# Altium schematic sheet PWR_Supply-5.5V.SchDoc: Phaser
size 420 x 297 mm; Author: G.Kasprowicz; CompanyName: WUT ISE; DrawnBy: G.Kasprowicz; Organization: WUT ISE; Address1: PW ISE; Address2: Nowowiejska 15/19 00-665 Warsaw; Address3: gkasprow@gmail.com; DocumentNumber: 17; Revision: 2; SheetNumber: 17; SheetTotal: 18; ModifiedBy: -; CheckedDate: -; Title2: P5V5 power rail and converters; DivGrp: WUT ISE; Designer: G.Kasprowicz; ModifiedDate: -; ProjectName: Sensor Box
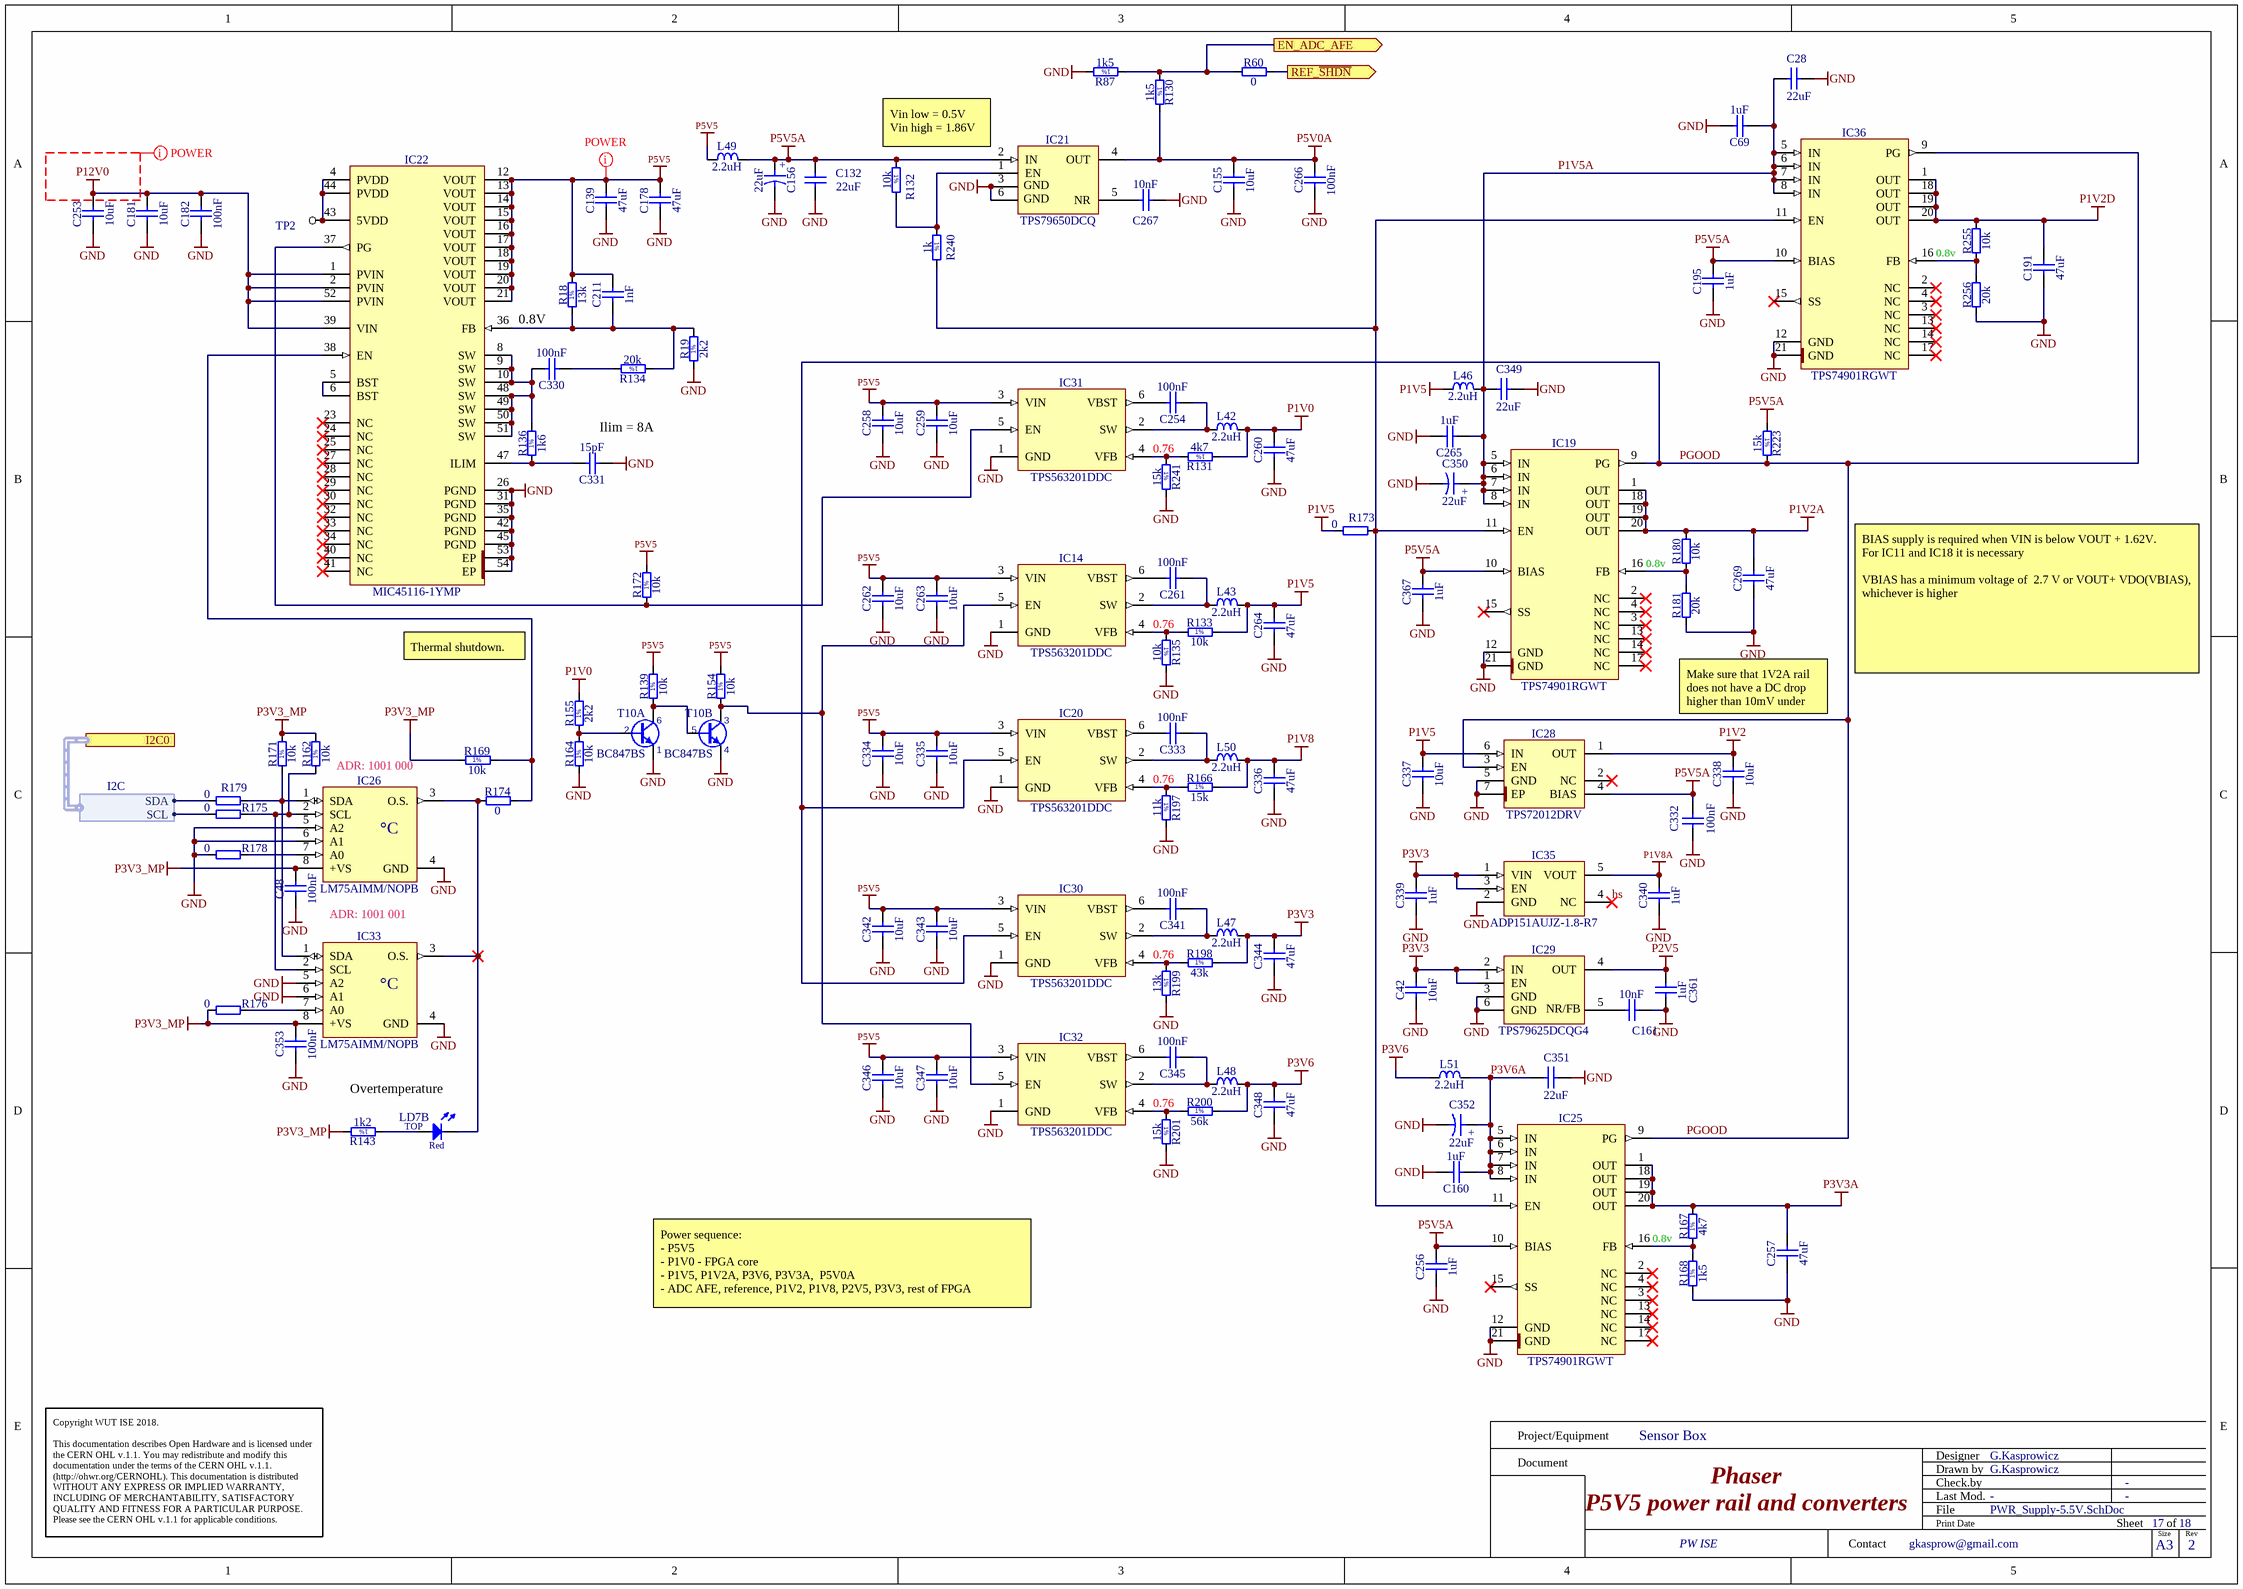
[diagram p0: PWR_Supply-5.5V.SchDoc]

## Parts
C28  22uF  [CAPC2012X135N]
C42  10uF  [CAPC2012X135N]
C48  100nF  [CAPC1005X55N]
C69  1uF  [CAPC1005X55N]
C132  22uF  [CAPC2012X135N]
C139  47uF  [CAPC3225X270N]
C155  10uF  [CAPC2012X135N]
C156  22uF  [CAPMP3528X210N]
C160  1uF  [CAPC1005X55N]
C161  10nF  [CAPC1005X55N]
C178  47uF  [CAPC3225X270N]
C181  10uF  [CAPC2012X135N]
C182  100nF  [CAPC1005X55N]
C191  47uF  [CAPC3225X270N]
C195  1uF  [CAPC1005X55N]
C211  1nF  [CAPC1608X87N]
C253  10uF  [CAPC2012X135N]
C254  100nF  [CAPC1005X55N]
C256  1uF  [CAPC1005X55N]
C257  47uF  [CAPC3225X270N]
C258  10uF  [CAPC2012X135N]
C259  10uF  [CAPC2012X135N]
C260  47uF  [CAPC3225X270N]
C261  100nF  [CAPC1005X55N]
C262  10uF  [CAPC2012X135N]
C263  10uF  [CAPC2012X135N]
C264  47uF  [CAPC3225X270N]
C265  1uF  [CAPC1005X55N]
C266  100nF  [CAPC1005X55N]
C267  10nF  [CAPC1005X55N]
C269  47uF  [CAPC3225X270N]
C330  100nF  [CAPC1005X55N]
C331  15pF  [CAPC1005X55N]
C332  100nF  [CAPC1005X55N]
C333  100nF  [CAPC1005X55N]
C334  10uF  [CAPC2012X135N]
C335  10uF  [CAPC2012X135N]
C336  47uF  [CAPC3225X270N]
C337  10uF  [CAPC2012X135N]
C338  10uF  [CAPC2012X135N]
C339  1uF  [CAPC1608X87N]
C340  1uF  [CAPC1608X87N]
C341  100nF  [CAPC1005X55N]
C342  10uF  [CAPC2012X135N]
C343  10uF  [CAPC2012X135N]
C344  47uF  [CAPC3225X270N]
C345  100nF  [CAPC1005X55N]
C346  10uF  [CAPC2012X135N]
C347  10uF  [CAPC2012X135N]
C348  47uF  [CAPC3225X270N]
C349  22uF  [CAPC2012X135N]
C350  22uF  [CAPMP3528X210N]
C351  22uF  [CAPC2012X135N]
C352  22uF  [CAPMP3528X210N]
C353  100nF  [CAPC1005X55N]
C361  1uF  [CAPC1608X87N]
C367  1uF  [CAPC1005X55N]
IC14  TPS563201DDC  [SOT95P280X110-6N]
IC19  TPS74901RGWT  [QFN65P500X500X100-21N-S325]
IC20  TPS563201DDC  [SOT95P280X110-6N]
IC21  TPS79650DCQ  [SOT127P700X180-6N]
IC22  MIC45116-1YMP  [MICROCHIP_H3QFN88-52LD-PL-3]
IC25  TPS74901RGWT  [QFN65P500X500X100-21N-S325]
IC26  LM75AIMM/NOPB  [SOP65P490X109-8N]
IC28  TPS72012DRV  [SON65P200X200X80-7N-R110X170]
IC29  TPS79625DCQG4  [SOT127P700X180-6N]
IC30  TPS563201DDC  [SOT95P280X110-6N]
IC31  TPS563201DDC  [SOT95P280X110-6N]
IC32  TPS563201DDC  [SOT95P280X110-6N]
IC33  LM75AIMM/NOPB  [SOP65P490X109-8N]
IC35  ADP151AUJZ-1.8-R7  [SOT95P280X90-5N]
IC36  TPS74901RGWT  [QFN65P500X500X100-21N-S325]
L42  2.2uH  [IND_BOURNS_SRP5015TA]
L43  2.2uH  [IND_BOURNS_SRP5015TA]
L46  2.2uH  [IND_BOURNS_SRP5015TA]
L47  2.2uH  [IND_BOURNS_SRP5015TA]
L48  2.2uH  [IND_BOURNS_SRP5015TA]
L49  2.2uH  [IND_BOURNS_SRP5015TA]
L50  2.2uH  [IND_BOURNS_SRP5015TA]
L51  2.2uH  [IND_BOURNS_SRP5015TA]
LD7  Red/Green  [LED_DIALIGHT_571-0112F]  (value not drawn)  (part B of 2)
R18  13k  [RESC1005X40N]
R19  2k2  [RESC1608X55N]
R60  0  [RESC1005X40N]
R87  1k5  [RESC1608X55N]
R130  1k5  [RESC1608X55N]
R131  4k7  [RESC1005X40N]
R132  10k  [RESC1005X40N]
R133  10k  [RESC1005X40N]
R134  20k  [RESC1005X40N]
R135  10k  [RESC1005X40N]
R136  1k6  [RESC1005X40N]
R139  10k  [RESC1005X40N]
R143  1k2  [RESC1608X55N]
R154  10k  [RESC1005X40N]
R155  2k2  [RESC1608X55N]
R162  10k  [RESC1005X40N]
R164  10k  [RESC1005X40N]
R166  15k  [RESC1005X40N]
R167  4k7  [RESC1608X55N]
R168  1k5  [RESC1608X55N]
R169  10k  [RESC1005X40N]
R171  10k  [RESC1005X40N]
R172  10k  [RESC1005X40N]
R173  0  [RESC1005X40N]
R174  0  [RESC1005X40N]
R175  0  [RESC1005X40N]
R176  0  [RESC1005X40N]
R178  0  [RESC1005X40N]
R179  0  [RESC1005X40N]
R180  10k  [RESC1608X55N]
R181  20k  [RESC1608X55N]
R197  11k  [RESC1005X40N]
R198  43k  [RESC1005X40N]
R199  13k  [RESC1005X40N]
R200  56k  [RESC1005X40N]
R201  15k  [RESC1005X40N]
R223  15k  [RESC1005X40N]
R240  1k  [RESC1608X55N]
R241  15k  [RESC1005X40N]
R255  10k  [RESC1608X55N]
R256  20k  [RESC1608X55N]
T10  BC847BS  [SOT65P210X110-6N]  (parts A,B of 2)
TP2  TP  [TP]  (value not drawn)

## Ports
EN_ADC_AFE (out), I2C0 (harness I2C), REF_~{SHDN} (out)

## Harnesses
I2C: SDA, SCL

## Nets
GND: C28.1 C42.1 C48.1 C69.2 C132.1 C139.1 C155.1 C156.2 C160.2 C161.1 C178.1 C181.1 C182.1 C191.1 C195.1 C253.1 C256.1 C257.1 C258.1 C259.1 C260.1 C262.1 C263.1 C264.1 C265.2 C266.1 C267.1 C269.1 C331.1 C332.1 C334.1 C335.1 C336.1 C337.1 C338.1 C339.1 C340.1 C342.1 C343.1 C344.1 C346.1 C347.1 C348.1 C349.1 C350.2 C351.1 C352.2 C353.1 C361.1 C367.1 IC14.1(GND) IC19.12(GND) IC19.21(GND) IC20.1(GND) IC21.3(GND) IC21.6(GND) IC22.26(PGND) IC22.31(PGND) IC22.35(PGND) IC22.42(PGND) IC22.45(PGND) IC22.53(EP) IC22.54(EP) IC25.12(GND) IC25.21(GND) IC26.4(GND) IC26.5(A2) IC26.6(A1) IC28.5(GND) IC28.7(EP) IC29.3(GND) IC29.6(GND) IC30.1(GND) IC31.1(GND) IC32.1(GND) IC33.4(GND) IC33.5(A2) IC33.6(A1) IC35.2(GND) IC36.12(GND) IC36.21(GND) R19.1 R87.2 R135.2 R164.1 R168.1 R178.1 R181.1 R197.2 R199.2 R201.2 R241.2 R256.1 T10.1(E) T10.4(E)
P1V0: C260.2 L42.2 R131.1 R155.2
P1V2: C338.2 IC28.1(OUT)
P1V2A: C269.2 IC19.1(OUT) IC19.18(OUT) IC19.19(OUT) IC19.20(OUT) R180.2
P1V2D: C191.2 IC36.1(OUT) IC36.18(OUT) IC36.19(OUT) IC36.20(OUT) R255.2
P1V5: C264.2 C337.2 IC28.6(IN) L43.2 L46.1 R133.2 R173.1
P1V8: C336.2 L50.2 R166.2
P1V8A: C340.2 IC35.5(VOUT)
P2V5: C361.2 IC29.4(OUT)
P3V3: C42.2 C339.2 C344.2 IC29.1(EN) IC29.2(IN) IC35.1(VIN) IC35.3(EN) L47.2 R198.2
P3V3_MP: C48.2 C353.2 IC26.8(+VS) IC33.8(+VS) R143.2 R162.2 R169.1 R171.2 R176.1
P3V3A: C257.2 IC25.1(OUT) IC25.18(OUT) IC25.19(OUT) IC25.20(OUT) R167.2
P3V6: C348.2 L48.2 L51.1 R200.2
P5V0A: C155.2 C266.2 IC21.4(OUT) R130.2
P5V5: C139.2 C178.2 C211.2 C258.2 C259.2 C262.2 C263.2 C334.2 C335.2 C342.2 C343.2 C346.2 C347.2 IC14.3(VIN) IC20.3(VIN) IC22.12(VOUT) IC22.13(VOUT) IC22.14(VOUT) IC22.15(VOUT) IC22.16(VOUT) IC22.17(VOUT) IC22.18(VOUT) IC22.19(VOUT) IC22.20(VOUT) IC22.21(VOUT) IC30.3(VIN) IC31.3(VIN) IC32.3(VIN) L49.1 R18.2 R139.2 R154.2 R172.2
P5V5A: C132.2 C156.1 C195.2 C256.2 C332.2 C367.2 IC19.10(BIAS) IC21.2(IN) IC25.10(BIAS) IC28.4(BIAS) IC36.10(BIAS) L49.2 R132.1 R223.1
P12V0: C181.2 C182.2 C253.2 IC22.1(PVIN) IC22.2(PVIN) IC22.39(VIN) IC22.52(PVIN)
EN_ADC_AFE: R60.1 R87.1 R130.1 ; port EN_ADC_AFE
hs: IC35.4(NC)
P1V5A: C28.2 C69.1 C265.1 C349.2 C350.1 IC19.5(IN) IC19.6(IN) IC19.7(IN) IC19.8(IN) IC36.5(IN) IC36.6(IN) IC36.7(IN) IC36.8(IN) L46.2
P3V6A: C160.1 C351.2 C352.1 IC25.5(IN) IC25.6(IN) IC25.7(IN) IC25.8(IN) L51.2
PGOOD: IC19.9(PG) IC20.5(EN) IC25.9(PG) IC28.3(EN) IC30.5(EN) IC36.9(PG) R223.2
REF_~{SHDN}: R60.2 ; port REF_~{SHDN}
NetC161_2: C161.2 IC29.5(NR/FB)
NetC211_1: C211.1 IC22.36(FB) R18.1 R19.2 R134.1
NetC254_1: C254.1 IC31.2(SW) L42.1
NetC254_2: C254.2 IC31.6(VBST)
NetC261_1: C261.1 IC14.2(SW) L43.1
NetC261_2: C261.2 IC14.6(VBST)
NetC267_2: C267.2 IC21.5(NR)
NetC330_1: C330.1 R134.2
NetC330_2: C330.2 IC22.8(SW) IC22.9(SW) IC22.10(SW) IC22.48(SW) IC22.49(SW) IC22.50(SW) IC22.51(SW) R136.2
NetC331_2: C331.2 IC22.47(ILIM) R136.1
NetC333_1: C333.1 IC20.2(SW) L50.1
NetC333_2: C333.2 IC20.6(VBST)
NetC341_1: C341.1 IC30.2(SW) L47.1
NetC341_2: C341.2 IC30.6(VBST)
NetC345_1: C345.1 IC32.2(SW) L48.1
NetC345_2: C345.2 IC32.6(VBST)
NetIC14_4: IC14.4(VFB) R133.1 R135.1
NetIC14_5: IC14.5(EN) IC32.5(EN) R154.1 T10.3(C)
NetIC19_11: IC19.11(EN) IC25.11(EN) IC36.11(EN) R173.2 R240.2
NetIC19_16: IC19.16(FB) R180.1 R181.2
NetIC20_4: IC20.4(VFB) R166.1 R197.1
NetIC21_1: IC21.1(EN) R132.2 R240.1
NetIC22_4: IC22.4(PVDD) IC22.43(5VDD) IC22.44(PVDD) TP2.1
NetIC22_5: IC22.5(BST) IC22.6(BST)
NetIC22_37: IC22.37(PG) IC31.5(EN) R172.1
NetIC22_38: IC22.38(EN) R169.2 R174.2
NetIC25_16: IC25.16(FB) R167.1 R168.2
NetIC26_1: IC26.1(SDA) IC33.1(SDA) R171.1 R179.2
NetIC26_2: IC26.2(SCL) IC33.2(SCL) R162.1 R175.2
NetIC26_3: IC26.3(O.S.) IC33.3(O.S.) LD7.3(C) R174.1
NetIC26_7: IC26.7(A0) R178.2
NetIC30_4: IC30.4(VFB) R198.1 R199.1
NetIC31_4: IC31.4(VFB) R131.2 R241.1
NetIC32_4: IC32.4(VFB) R200.1 R201.1
NetIC33_7: IC33.7(A0) R176.2
NetIC36_16: IC36.16(FB) R255.1 R256.2
NetLD7_4: LD7.4(A) R143.1
NetR139_1: R139.1 T10.5(B) T10.6(C)
NetR155_1: R155.1 R164.2 T10.2(B)
NetR175_1: R175.1 ; port I2C0.SCL
NetR179_1: R179.1 ; port I2C0.SDA

Not connected (* = marked no-connect by the designer): IC19 2(NC)* 3(NC)* 4(NC)* 13(NC)* 14(NC)* 15(SS)* 17(NC)*; IC22 23(NC)* 24(NC)* 25(NC)* 27(NC)* 28(NC)* 29(NC)* 30(NC)* 32(NC)* 33(NC)* 34(NC)* 40(NC)* 41(NC)*; IC25 2(NC)* 3(NC)* 4(NC)* 13(NC)* 14(NC)* 15(SS)* 17(NC)*; IC28 2(NC)*; IC36 2(NC)* 3(NC)* 4(NC)* 13(NC)* 14(NC)* 15(SS)* 17(NC)*

## Layout directives
net class POWER: P5V5, P12V0

## Notes on the sheet
- Vin low = 0.5V
  Vin high = 1.86V
- 0.8v
- 0.8V
- (near C331) Ilim = 8A
- 0.76
- Thermal shutdown.
- BIAS supply is required when VIN is below VOUT + 1.62V.
  For IC11 and IC18 it is necessary
  VBIAS has a minimum voltage of  2.7 V or VOUT+ VDO(VBIAS), whichever is higher
- Make sure that 1V2A rail does not have a DC drop higher than 10mV under full load
- ADR: 1001 000
- ADR: 1001 001
- Overtemperature
- Power sequence:
  - P5V5
  - P1V0 - FPGA core
  - P1V5, P1V2A, P3V6, P3V3A,  P5V0A
  - ADC AFE, reference, P1V2, P1V8, P2V5, P3V3, rest of FPGA
- Project/Equipment
- Document
- Designer
- Drawn by
- Check.by
- Copyright WUT ISE 2018.
  This documentation describes Open Hardware and is licensed under the CERN OHL v.1.1. You may redistribute and modify this documentation under the terms of the CERN OHL v.1.1. (http://ohwr.org/CERNOHL). This documentation is distributed WITHOUT ANY EXPRESS OR IMPLIED WARRANTY, INCLUDING OF MERCHANTABILITY, SATISFACTORY QUALITY AND FITNESS FOR A PARTICULAR PURPOSE. Please see the CERN OHL v.1.1 for applicable conditions.
- Contact
- File
- Last Mod.
- Print Date
- Sheet
- Size
- A3
- of
- Rev
- (in symbol CTE3528-21_22UF_10V_10%_LESR0700) +
- (in symbol LED_DIALIGHT_571-0112F, part B) TOP; Red
- (in symbol LM75AIMM/NOPB) °C
- (in symbol R0402_1K6_1%_0.0625W_100PPM) 1%
- (in symbol R0402_4K7_1%_0.0625W_100PPM) 1%
- (in symbol R0402_10K_1%_0.0625W_100PPM) 1%
- (in symbol R0402_10k_1%_0.0625W_100PPM) 1%
- (in symbol R0402_11K_1%_0.0625W_100PPM) 1%
- (in symbol R0402_13K_1%_0.0625W_100PPM) 1%
- (in symbol R0402_15K_1%_0.0625W_100PPM) 1%
- (in symbol R0402_20K_1%_0.0625W_100PPM) 1%
- (in symbol R0402_43K_1%_0.0625W_100PPM) 1%
- (in symbol R0402_56K_1%_0.0625W_100PPM) 1%
- (in symbol R0603_1K2_1%_0.1W_100PPM) 1%
- (in symbol R0603_1K5_1%_0.1W_100PPM) 1%
- (in symbol R0603_1K_1%_0.1W_100PPM) 1%
- (in symbol R0603_2k2_1%_0.1W_100PPM) 1%
- (in symbol R0603_4K7_1%_0.1W_100PPM) 1%

## Library data of the parts
C28 C132 C349 C351 = CC0805_22UF_16V_10%_X5R: Non-polarised capacitor; Part Description: SMD Multilayer Chip Ceramic Capacitor; Manufacturer: GENERIC; Manufacturer1 Part Number: C2012X5R1C226KT; Voltage: 16V; TC: X5R; Tolerance: ±10%; Part Number: CC0805_22UF_16V_10%_X5R; Component Kind: Standard; Component Type: Standard; Pin Count: 2; Value: 22uF; Status: Preferred; Manufacturer Part Number: CC0805_22UF_16V_10%_X5R; Case: 0805; Mounted: Yes; Socket: No; SMD: Yes; Sense: No; Manufacturer1 Example: TDK; Manufacturer1 ComponentHeight: 1.35mm; HelpURL: \\cern.ch\dfs\Applications\Altium\Datasheets\CC0805_X5R_TDK_C.pdf; Author: CERN DEM JLC; CreateDate: 25.10.2012; LatestRevisionDate: 25.10.2012
C42 C155 C181 C253 C258 C259 C262 C263 C334 C335 C337 C338 C342 C343 C346 C347 = CC0805_10UF_16V_10%_X5R: Non-polarised capacitor; Part Description: SMD Multilayer Chip Ceramic Capacitor; Manufacturer: GENERIC; Manufacturer1 Part Number: C0805C106K4PAC; Voltage: 16V; TC: X5R; Tolerance: ±10%; Part Number: CC0805_10UF_16V_10%_X5R; Component Kind: Standard; Component Type: Standard; Pin Count: 2; Value: 10uF; Status: Preferred; Manufacturer Part Number: CC0805_10UF_16V_10%_X5R; Case: 0805; Mounted: Yes; Socket: No; SMD: Yes; Sense: No; Manufacturer1 Example: KEMET; Manufacturer1 ComponentHeight: 1.4mm; HelpURL: \\cern.ch\dfs\Applications\Altium\Datasheets\CC1206_X5R_KEMET.pdf; Author: CERN DEM JLC; CreateDate: 03.12.2007; LatestRevisionDate: 03.12.2007
C48 C266 C353 = CC0402_100NF_16V_10%_X5R: Non-polarised capacitor; Part Description: SMD Multilayer Chip Ceramic Capacitor; Manufacturer: GENERIC; Manufacturer1 Part Number: GRM155R61C104KA88D; Voltage: 16V; TC: X5R; Tolerance: ±10%; Part Number: CC0402_100NF_16V_10%_X5R; Component Kind: Standard; Component Type: Standard; Pin Count: 2; Value: 100nF; Status: None; Manufacturer Part Number: CC0402_100NF_16V_10%_X5R; Case: 0402; Mounted: Yes; Socket: No; SMD: Yes; Sense: No; Manufacturer1 Example: MURATA; Manufacturer1 ComponentHeight: 0.55mm; HelpURL: \\cern.ch\dfs\Applications\Altium\Datasheets\CC0402_X5R_MURATA_GRM.pdf; Author: CERN DEM JLC; CreateDate: 10.12.2013; LatestRevisionDate: 10.12.2013
C69 C160 C195 C256 C265 C367 = CC0402_1UF_16V_10%_X5R: Non-polarised capacitor; Part Description: SMD Multilayer Chip Ceramic Capacitor; Manufacturer: GENERIC; Manufacturer1 Part Number: C1005X5R1C105KT; Voltage: 16V; TC: X5R; Tolerance: ±10%; Part Number: CC0402_1UF_16V_10%_X5R; Component Kind: Standard; Component Type: Standard; Pin Count: 2; Value: 1uF; Status: Preferred; Manufacturer Part Number: CC0402_1UF_16V_10%_X5R; Case: 0402; Mounted: Yes; Socket: No; SMD: Yes; Sense: No; Manufacturer1 Example: TDK; Manufacturer1 ComponentHeight: 0.55mm; HelpURL: \\cern.ch\dfs\Applications\Altium\Datasheets\CC0402_X5R_TDK_C.pdf; Author: CERN DEM JLC; CreateDate: 2012-10-25; LatestRevisionDate: 2012-10-25
C139 C178 C191 C257 C260 C264 C269 C336 C344 C348 = CC1210_47UF_10V_20%_X5R: Non-polarised capacitor; Part Description: SMD Multilayer Chip Ceramic Capacitor; Manufacturer: GENERIC; Manufacturer1 Part Number: LMK325BJ476MM-T; Voltage: 10V; TC: X5R; Tolerance: ±20%; Part Number: CC1210_47UF_10V_20%_X5R; Component Kind: Standard; Component Type: Standard; Pin Count: 2; Value: 47uF; Status: None; Manufacturer Part Number: CC1210_47UF_10V_20%_X5R; Case: 1210; Mounted: Yes; Socket: No; SMD: Yes; Sense: No; Manufacturer1 Example: TAIYO YUDEN; Manufacturer1 ComponentHeight: 2.7mm; HelpURL: \\cern.ch\dfs\Applications\Altium\Datasheets\CC1210_X5R_TAIYO-YUDEN_HIGH-VALUE.pdf; Author: CERN DEM JLC; CreateDate: 04.05.2011; LatestRevisionDate: 04.05.2011
C156 C350 C352 = CTE3528-21_22UF_10V_10%_LESR0700: Polarised capacitor; Part Description: Low ESR 0R7 Solid Tantalum Chip Capacitor; Manufacturer: GENERIC; Manufacturer1 Part Number: TPSB226K010R0700; Voltage: 10V; Tolerance: ±10%; Part Number: CTE3528-21_22UF_10V_10%_LESR0700; Component Kind: Standard; Component Type: Standard; Pin Count: 2; Value: 22uF; Status: Preferred; Manufacturer Part Number: CTE3528-21_22UF_10V_10%_LESR0700; Case: B; Mounted: Yes; Socket: No; SMD: Yes; Sense: No; Manufacturer1 Example: AVX; Manufacturer1 ComponentHeight: 2.1mm; HelpURL: \\cern.ch\dfs\Applications\Altium\Datasheets\CTE-LESR_AVX_TPS.pdf; Author: CERN DEM JLC; CreateDate: 05.05.2008; LatestRevisionDate: 20.01.2009
C161 C267 = CC0402_10NF_25V_10%_X7R: Non-polarised capacitor; Part Description: SMD Multilayer Chip Ceramic Capacitor; Manufacturer: GENERIC; Manufacturer1 Part Number: C1005X7R1E103KT; Voltage: 25V; TC: X7R; Tolerance: ±10%; Part Number: CC0402_10NF_25V_10%_X7R; Component Kind: Standard; Component Type: Standard; Pin Count: 2; Value: 10nF; Status: Preferred; Manufacturer Part Number: CC0402_10NF_25V_10%_X7R; Case: 0402; Mounted: Yes; Socket: No; SMD: Yes; Sense: No; Manufacturer1 Example: TDK; Manufacturer1 ComponentHeight: 0.55mm; HelpURL: \\cern.ch\dfs\Applications\Altium\Datasheets\CC0402_X7R_TDK_C.pdf; Author: CERN DEM JLC; CreateDate: 25.10.2012; LatestRevisionDate: 25.10.2012
C182 C254 C261 C330 C332 C333 C341 C345 = CC0402_100NF_16V_10%_X5R: Non-polarised capacitor; Part Description: SMD Multilayer Chip Ceramic Capacitor; Manufacturer: GENERIC; Manufacturer1 Part Number: GRM155R61C104KA88D; Voltage: 16V; TC: X5R; Tolerance: ±10%; Table: Capacitors SMD; Part Number: CC0402_100NF_16V_10%_X5R; Component Kind: Standard; Component Type: Standard; Pin Count: 2; Value: 100nF; Status: None; Manufacturer Part Number: CC0402_100NF_16V_10%_X5R; Case: 0402; Mounted: Yes; Socket: No; SMD: Yes; Manufacturer1 Example: MURATA; Manufacturer1 ComponentHeight: 0.55mm; HelpURL: \\cern.ch\dfs\Applications\Altium\Datasheets\CC0402_X5R_MURATA_GRM.pdf; Author: CERN DEM JLC; CreateDate: 2013-12-10; LatestRevisionDate: 2013-12-10
C211 = CC0603_1NF_100V_10%_X7R: Non-polarised capacitor; Part Description: SMD Multilayer Chip Ceramic Capacitor; Manufacturer: GENERIC; Manufacturer1 Part Number: C0603C102K1RACTU; Voltage: 100V; TC: X7R; Tolerance: ±10%; Part Number: CC0603_1NF_100V_10%_X7R; Component Kind: Standard; Component Type: Standard; Pin Count: 2; Value: 1nF; Status: Preferred; Manufacturer Part Number: CC0603_1NF_100V_10%_X7R; Case: 0603; Mounted: Yes; Socket: No; SMD: Yes; Sense: No; Manufacturer1 Example: KEMET; Manufacturer1 ComponentHeight: 0.87mm; HelpURL: \\cern.ch\dfs\Applications\Altium\Datasheets\CC0603_X7R_KEMET.pdf; Author: CERN DEM JLC; CreateDate: 12.12.2013; LatestRevisionDate: 12.12.2013
C331 = CC0402_15PF_50V_5%_C0G: Non-polarised capacitor; Part Description: SMD Multilayer Chip Ceramic Capacitor; Manufacturer: GENERIC; Manufacturer1 Part Number: C0402C150J5GACTU; Voltage: 50V; TC: C0G/NP0; Tolerance: ±5%; Part Number: CC0402_15PF_50V_5%_C0G; Component Kind: Standard; Component Type: Standard; Pin Count: 2; Value: 15pF; Status: Preferred; Manufacturer Part Number: CC0402_15PF_50V_5%_C0G; Case: 0402; Mounted: Yes; Socket: No; SMD: Yes; Sense: No; Manufacturer1 Example: KEMET; Manufacturer1 ComponentHeight: 0.55mm; HelpURL: \\cern.ch\dfs\Applications\Altium\Datasheets\CC0805_C0G_KEMET_(Commercial Grade).pdf; Author: CERN DEM JLC; CreateDate: 03.12.2007; LatestRevisionDate: 22.04.2015
C339 C340 C361 = CC0603_1UF_25V_10%_X7R: Non-polarised capacitor; Part Description: SMD Multilayer Chip Ceramic Capacitor; Manufacturer: GENERIC; Manufacturer1 Part Number: GRM188R71E105KA12D; Voltage: 25V; TC: X7R; Tolerance: ±10%; Part Number: CC0603_1UF_25V_10%_X7R; Component Kind: Standard; Component Type: Standard; Pin Count: 2; Value: 1uF; Status: None; Manufacturer Part Number: CC0603_1UF_25V_10%_X7R; Case: 0603; Mounted: Yes; Socket: No; SMD: Yes; Sense: No; Manufacturer1 Example: MURATA; Manufacturer1 ComponentHeight: 0.9mm; HelpURL: \\cern.ch\dfs\Applications\Altium\Datasheets\CC0603_X7R_MURATA.pdf; Author: CERN DEM JLC; CreateDate: 18.01.2011; LatestRevisionDate: 18.01.2011
IC14 IC20 IC30-IC32 = TPS563201DDC: 4.5V to 17V Input, 3A Synchronous Step-Down Voltage Regulator; Manufacturer: TEXAS INSTRUMENTS; PressFit: No; Bonding: No; Part Number: TPS563201DDC; Component Kind: Standard; Component Type: Standard; Device: TPS563201DDC; PackageDescription: SOT, 0.95mm Pitch; 6 Pin, 1.60mm W X 2.90mm L X 1.10mm H Body, IPC Medium Density; Part Description: 4.5V to 17V Input, 3A Synchronous Step-Down Voltage Regulator; Manufacturer Part Number: TPS563201DDC; Pin Count: 6; Case: SOT23-6; Mounted: Yes; Socket: No; SMD: Yes; Sense: No; ComponentHeight: 1.1mm; HelpURL: \\cern.ch\dfs\Applications\Altium\Datasheets\TPS563201DDC.pdf; Author: CERN DEM MR; CreateDate: 23.08.2018; LatestRevisionDate: 23.08.2018
IC19 IC25 IC36 = TPS74901RGWT: 3A, 0.8 to 3.6V Adjustable Low-Dropout Linear Regulator with Programmable Soft-Start; Part Description: 0.8V to 3.6V, 3.0A Low Dropout Linear Regulator with Programmable Soft-Start; Manufacturer: TEXAS INSTRUMENTS; PressFit: No; Bonding: No; Part Number: TPS74901RGWT; Component Kind: Standard; Component Type: Standard; Device: TPS74901RGWT; PackageDescription: QFN, 0.65mm pitch,square; 20 pin, 5mm X 5mm X 1mm H body (w/thermal tab 3.25 X 3.25mm),  IPC Medium Density; Manufacturer Part Number: TPS74901RGWT; Pin Count: 21; Case: QFN20; Mounted: Yes; Socket: No; SMD: Yes; Sense: No; ComponentHeight: 1mm; HelpURL: \\cern.ch\dfs\Applications\Altium\Datasheets\TPS74901RGWT.pdf; Author: CERN DEM JLC; CreateDate: 07.03.2013; LatestRevisionDate: 07.03.2013
IC21 = TPS79650DCQ: 5V Ultralow-Noise, High-PSRR, Fast, RF, 1.5A Low-Dropout Linear Regulator; Manufacturer: TEXAS INSTRUMENTS; PressFit: No; Bonding: No; Part Number: TPS79650DCQ; Component Kind: Standard; Component Type: Standard; Device: TPS79650DCQ; PackageDescription: SOT223, 6-Leads, Body 6.6x7.3mm (max), Pitch 1.27mm, IPC Medium Density; Part Description: 5V Ultralow-Noise, High-PSRR, Fast, RF, 1.5A Low-Dropout Linear Regulator; Manufacturer Part Number: TPS79650DCQ; Pin Count: 6; Case: SOT223; Mounted: Yes; Socket: No; SMD: Yes; Sense: No; ComponentHeight: 1.8mm; HelpURL: \\cern.ch\dfs\Applications\Altium\Datasheets\TPS78633DCQ.pdf; Author: GK; CreateDate: 07.10.2008; LatestRevisionDate: 13.02.2017
IC22 = MIC45116-1YMP: 0.8V to 85% PVIN (4.75-19V), 6A Synchronous Step-Down Regulator Module; Manufacturer: MICROCHIP TECHNOLOGY; PressFit: No; Bonding: No; Part Number: MIC45116-1YMP; Component Kind: Standard; Component Type: Standard; Device: MIC45116-1YMP; PackageDescription: MICROCHIP_H3QFN88-52LD-PL-3, 0.50mm Pitch, Square, 52 Pin, 8mm L X 8mm W X 3mm H Body; Part Description: 0.8V to 85% PVIN (4.75-19V), 6A Synchronous Step-Down Regulator Module; Manufacturer Part Number: MIC45116-1YMP; Pin Count: 53; Mounted: Yes; Socket: No; SMD: Yes; Sense: No; ComponentHeight: 3mm; HelpURL: \\cern.ch\dfs\Applications\Altium\Datasheets\MIC45116-1YMP.pdf; Author: CERN DEM JMW; CreateDate: 15.08.2016; LatestRevisionDate: 15.08.2016
IC26 IC33 = LM75AIMM/NOPB: Digital Temperature Sensor and Thermal Watchdog with Two-Wire Interface; Part Description: -25° to +100°C ±2°C Digital Temperature Sensor and Thermal Watchdog with Two-Wire Interface; Manufacturer: TEXAS INSTRUMENTS; PressFit: No; Bonding: No; Part Number: LM75AIMM/NOPB; Component Kind: Standard; Component Type: Standard; Device: LM75AIMM/NOPB; PackageDescription: SOP, 0.65mm pitch; 8 pin,3.00mm W X 3.00mm L X 1.09mm H bodyI, PC Medium Density; Manufacturer Part Number: LM75AIMM/NOPB; Pin Count: 8; Case: SSOP8; Mounted: Yes; Socket: No; SMD: Yes; Sense: No; ComponentHeight: 1.09mm; HelpURL: \\cern.ch\dfs\Applications\Altium\Datasheets\LM75AIMM-NOPB.pdf; Author: CERN DEM JLC; CreateDate: 15.10.2012; LatestRevisionDate: 15.10.2012
IC28 = TPS72012DRV: 350 mA, Ultra-Low VIN, RF Low-Dropout Linear Regulator With Bias Pin; Part Description: 1.2V, 350mA, Ultra-Low Vin, RF Low-Dropout Linear Regulator With Bias Pin; Manufacturer: TEXAS INSTRUMENTS; PressFit: No; Bonding: No; Part Number: TPS72012DRV; Component Kind: Standard; Component Type: Standard; Device: TPS72012DRV; PackageDescription: SON, 0.65mm, Pitch; 6 Pin,2.00mm W X 2.00mm L X 0.80mm H body (W/Thermal Tab 1.1mm X 1.7mm),  IPC Medium Density; Manufacturer Part Number: TPS72012DRV; Pin Count: 7; Case: SON6; Mounted: Yes; Socket: No; SMD: Yes; Sense: No; ComponentHeight: 0.8mm; HelpURL: \\cern.ch\dfs\Applications\Altium\Datasheets\TPS72012DRV.pdf; Author: CERN DEM JMW; CreateDate: 2019-12-02; LatestRevisionDate: 2019-12-02
IC29 = TPS79625DCQG4: Ultralow-Noise, High-PSRR, Fast, RF, 1A Low-Dropout Linear Regulator; Part Description: 2.5V Ultralow-Noise, High-PSRR, Fast, RF, 1A Low-Dropout Linear Regulator; Manufacturer: TEXAS INSTRUMENTS; PressFit: No; Bonding: No; Part Number: TPS79625DCQG4; Component Kind: Standard; Component Type: Standard; Device: TPS79625DCQG4; PackageDescription: SOT223, 6-Leads, Body 6.6x7.3mm (max), Pitch 1.27mm, IPC Medium Density; Manufacturer Part Number: TPS79625DCQG4; Pin Count: 6; Case: SOT223; Mounted: Yes; Socket: No; SMD: Yes; Sense: No; ComponentHeight: 1.8mm; HelpURL: \\cern.ch\dfs\Applications\Altium\Datasheets\TPS79625DCQG4.pdf; Author: CERN DEM JLC; CreateDate: 14.08.2013; LatestRevisionDate: 14.08.2013
IC35 = REG_ADP151AUJZ-1.8-R7: 1.8V Ultralow Noise, 200 mA CMOS Linear Regulator; Part Description: 1.8V, 200mA, Ultralow Noise, CMOS Linear Regulator; Manufacturer: ANALOG DEVICES; PressFit: No; Bonding: No; Part Number: ADP151AUJZ-1.8-R7; Component Kind: Standard; Component Type: Standard; Device: ADP151AUJZ-1.8-R7; PackageDescription: SOT23, 0.95mm pitch; 5 pin, 1.75mm W X 3.00mm L, IPC Medium Density; Manufacturer Part Number: ADP151AUJZ-1.8-R7; Pin Count: 5; Case: SOT23; Mounted: Yes; Socket: No; SMD: Yes; Sense: No; ComponentHeight: 0.9mm; HelpURL: \\cern.ch\dfs\Applications\Altium\Datasheets\ADP151AUJZ-1.2-R7.pdf; Author: GK; CreateDate: 21.11.2011; LatestRevisionDate: 19.06.2014
L42 L43 L46-L51 = IND_2.2UH_20%_BOURNS_SRP5015TA: Inductor; Part Description: Shielded SMD Power Inductor; Manufacturer: BOURNS; Manufacturer Part Number: SRP5015TA-2R2M; Power: 4A; Resistance: 0.045R; Tolerance: ±20%; Part Number: IND_2.2UH_20%_BOURNS_SRP5015TA; Component Kind: Standard; Component Type: Standard; Pin Count: 2; Value: 2.2uH; Status: None; Mounted: Yes; Socket: No; SMD: Yes; Sense: No; ComponentHeight: 1.5mm; HelpURL: \\cern.ch\dfs\Applications\Altium\Datasheets\IND_BOURNS_SRP5015TA.pdf; Author: CERN DEM JMW; CreateDate: 24.06.2019; LatestRevisionDate: 24.06.2019
LD7 = LED_DIALIGHT_571-0112F: 2x LED  Botom Green, Top Red; Part Description: Dual 2mm  LEDs, Red Top,Green Bot, CBI® Circuit Board Indicator (Without positioning pins); PressFit: No; Bonding: No; Part Number: LED_DIALIGHT_571-0112F; Component Kind: Standard; Component Type: Standard; Color: Red/Green; PackageDescription: 2x 2mm LED (Top: Red, Bot: Green) PCB Edge Mounting (Without positioning pins) DIALIGHT 571 Serie; Manufacturer: DIALIGHT; Manufacturer Part Number: 571-0112F; Pin Count: 4; Mounted: Yes; Socket: No; SMD: No; Sense: No; ComponentHeight: 8.6mm; HelpURL: \\cern.ch\dfs\Applications\Altium\Datasheets\LED_DIALIGHT_571-0112F.pdf; Author: CERN DEM JLC; CreateDate: 09.11.2009; LatestRevisionDate: 17.03.2010
R18 R199 = R0402_13K_1%_0.0625W_100PPM: Resistor - 1%; Part Description: General Purpose Thick Film Chip Resistor; Manufacturer: GENERIC; Manufacturer1 Part Number: 232270671303L; TC: ±100ppm/°C; PressFit: No; Part Number: R0402_13K_1%_0.0625W_100PPM; Component Kind: Standard; Component Type: Standard; Pin Count: 2; Value: 13k; Status: Not Recommended; Power: 0.0625W; Tolerance: ±1%; Manufacturer Part Number: R0402_13K_1%_0.0625W_100PPM; Case: 0402; Mounted: Yes; Sense: No; Socket: No; SMD: Yes; Manufacturer1 Example: YAGEO PHYCOMP; Manufacturer1 ComponentHeight: 0.4mm; HelpURL: \\cern.ch\dfs\Applications\Altium\Datasheets\R0402_Phycomp_RC0402.pdf; Author: CERN DEM JLC; CreateDate: 03.12.2007; LatestRevisionDate: 17.10.2012
R19 R155 = R0603_2k2_1%_0.1W_100PPM: Resistor - 1%; Part Description: General Purpose Thick Film Chip Resistor; Manufacturer: GENERIC; Manufacturer1 Part Number: NRC06F2201TRF; Power: 0.1W; TC: ±100ppm/°C; PressFit: No; Part Number: R0603_2K2_1%_0.1W_100PPM; Component Kind: Standard; Component Type: Standard; Pin Count: 2; Value: 2k2; Status: Preferred; Tolerance: ±1%; Manufacturer Part Number: R0603_2K2_1%_0.1W_100PPM; Case: 0603; Mounted: Yes; Sense: No; Socket: No; SMD: Yes; Manufacturer1 Example: NIC COMPONENT; Manufacturer1 ComponentHeight: 0.55mm; HelpURL: \\cern.ch\dfs\Applications\Altium\Datasheets\R0603_NIC_NRC.pdf; Author: CERN DEM JLC; CreateDate: 03.12.2007; LatestRevisionDate: 13.03.2008
R60 R173-R176 R178 R179 = R0402_0R_JUMPER: Resistor; Part Description: 1A (0.05R Max DC Resistance) Zero Ohm Jumper; Manufacturer: GENERIC; Manufacturer1 Part Number: 232270591001L; Part Number: R0402_0R_JUMPER; Component Kind: Standard; Component Type: Standard; Pin Count: 2; Value: 0; Status: Not recommended; Manufacturer Part Number: R0402_0R_JUMPER; Case: 0402; Mounted: Yes; Sense: No; Socket: No; SMD: Yes; Manufacturer1 Example: YAGEO PHYCOMP; Manufacturer1 ComponentHeight: 0.4mm; HelpURL: \\cern.ch\dfs\Applications\Altium\Datasheets\R0402_Phycomp_RC0402.pdf; Author: CERN DEM JLC; CreateDate: 03.12.2007; LatestRevisionDate: 17.10.2012
R87 R130 R168 = R0603_1K5_1%_0.1W_100PPM: Resistor - 1%; Part Description: General Purpose Thick Film Chip Resistor; Manufacturer: GENERIC; Manufacturer1 Part Number: NRC06F1501TRF; Power: 0.1W; TC: ±100ppm/°C; PressFit: No; Part Number: R0603_1K5_1%_0.1W_100PPM; Component Kind: Standard; Component Type: Standard; Pin Count: 2; Value: 1k5; Status: Preferred; Tolerance: ±1%; Manufacturer Part Number: R0603_1K5_1%_0.1W_100PPM; Case: 0603; Mounted: Yes; Sense: No; Socket: No; SMD: Yes; Manufacturer1 Example: NIC COMPONENT; Manufacturer1 ComponentHeight: 0.55mm; HelpURL: \\cern.ch\dfs\Applications\Altium\Datasheets\R0603_NIC_NRC.pdf; Author: CERN DEM JLC; CreateDate: 03.12.2007; LatestRevisionDate: 13.03.2008
R131 = R0402_4K7_1%_0.0625W_100PPM: Resistor - 1%; Part Description: General Purpose Thick Film Chip Resistor; Manufacturer: GENERIC; Manufacturer1 Part Number: 232270674702L; TC: ±100ppm/°C; PressFit: No; Part Number: R0402_4K7_1%_0.0625W_100PPM; Component Kind: Standard; Component Type: Standard; Pin Count: 2; Value: 4k7; Status: Not Recommended; Power: 0.0625W; Tolerance: ±1%; Manufacturer Part Number: R0402_4K7_1%_0.0625W_100PPM; Case: 0402; Mounted: Yes; Sense: No; Socket: No; SMD: Yes; Manufacturer1 Example: YAGEO PHYCOMP; Manufacturer1 ComponentHeight: 0.4mm; HelpURL: \\cern.ch\dfs\Applications\Altium\Datasheets\R0402_Phycomp_RC0402.pdf; Author: CERN DEM JLC; CreateDate: 03.12.2007; LatestRevisionDate: 17.10.2012
R132 = R0402_10k_1%_0.0625W_100PPM: Resistor - 1%; Part Description: General Purpose Thick Film Chip Resistor; Manufacturer: GENERIC; Manufacturer1 Part Number: 232270671003L; TC: ±100ppm/°C; PressFit: No; Part Number: R0402_10K_1%_0.0625W_100PPM; Component Kind: Standard; Component Type: Standard; Pin Count: 2; Value: 10k; Status: Not Recommended; Power: 0.0625W; Tolerance: ±1%; Manufacturer Part Number: R0402_10K_1%_0.0625W_100PPM; Case: 0402; Mounted: Yes; Sense: No; Socket: No; SMD: Yes; Manufacturer1 Example: YAGEO PHYCOMP; Manufacturer1 ComponentHeight: 0.4mm; HelpURL: \\cern.ch\dfs\Applications\Altium\Datasheets\R0402_Phycomp_RC0402.pdf; Author: CERN DEM JLC; CreateDate: 03.12.2007; LatestRevisionDate: 17.10.2012
R133 R135 R139 R154 R162 R164 R169 R171 R172 = R0402_10K_1%_0.0625W_100PPM: Resistor - 1%; Part Description: General Purpose Thick Film Chip Resistor; Manufacturer: GENERIC; Manufacturer1 Part Number: 232270671003L; TC: ±100ppm/°C; PressFit: No; Part Number: R0402_10K_1%_0.0625W_100PPM; Component Kind: Standard; Component Type: Standard; Pin Count: 2; Value: 10k; Status: Not Recommended; Power: 0.0625W; Tolerance: ±1%; Manufacturer Part Number: R0402_10K_1%_0.0625W_100PPM; Case: 0402; Mounted: Yes; Sense: No; Socket: No; SMD: Yes; Manufacturer1 Example: YAGEO PHYCOMP; Manufacturer1 ComponentHeight: 0.4mm; HelpURL: \\cern.ch\dfs\Applications\Altium\Datasheets\R0402_Phycomp_RC0402.pdf; Author: CERN DEM JLC; CreateDate: 03.12.2007; LatestRevisionDate: 17.10.2012
R134 = R0402_20K_1%_0.0625W_100PPM: Resistor - 1%; Part Description: General Purpose Thick Film Chip Resistor; Manufacturer: GENERIC; Manufacturer1 Part Number: 232270672003L; TC: ±100ppm/°C; PressFit: No; Part Number: R0402_20K_1%_0.0625W_100PPM; Component Kind: Standard; Component Type: Standard; Pin Count: 2; Value: 20k; Status: Not Recommended; Power: 0.0625W; Tolerance: ±1%; Manufacturer Part Number: R0402_20K_1%_0.0625W_100PPM; Case: 0402; Mounted: Yes; Socket: No; SMD: Yes; Manufacturer1 Example: YAGEO PHYCOMP; Manufacturer1 ComponentHeight: 0.4mm; HelpURL: \\cern.ch\dfs\Applications\Altium\Datasheets\R0402_Phycomp_RC0402.pdf; Author: CERN DEM JLC; CreateDate: 03.12.2007; LatestRevisionDate: 17.10.2012; Sense: No
R136 = R0402_1K6_1%_0.0625W_100PPM: Resistor - 1%; Part Description: General Purpose Thick Film Chip Resistor; Manufacturer: GENERIC; Manufacturer1 Part Number: 232270671602L; TC: ±100ppm/°C; PressFit: No; Part Number: R0402_1K6_1%_0.0625W_100PPM; Component Kind: Standard; Component Type: Standard; Pin Count: 2; Value: 1k6; Status: Not Recommended; Power: 0.0625W; Tolerance: ±1%; Manufacturer Part Number: R0402_1K6_1%_0.0625W_100PPM; Case: 0402; Mounted: Yes; Sense: No; Socket: No; SMD: Yes; Manufacturer1 Example: YAGEO PHYCOMP; Manufacturer1 ComponentHeight: 0.4mm; HelpURL: \\cern.ch\dfs\Applications\Altium\Datasheets\R0402_Phycomp_RC0402.pdf; Author: CERN DEM JLC; CreateDate: 03.12.2007; LatestRevisionDate: 17.10.2012
R143 = R0603_1K2_1%_0.1W_100PPM: Resistor - 1%; Part Description: General Purpose Thick Film Chip Resistor; Manufacturer: GENERIC; Manufacturer1 Part Number: NRC06F1201TRF; Power: 0.1W; TC: ±100ppm/°C; Part Number: R0603_1K2_1%_0.1W_100PPM; Component Kind: Standard; Component Type: Standard; Pin Count: 2; Value: 1k2; Status: Preferred; Tolerance: ±1%; Manufacturer Part Number: R0603_1K2_1%_0.1W_100PPM; Case: 0603; Mounted: Yes; Sense: No; Socket: No; SMD: Yes; Manufacturer1 Example: NIC COMPONENT; Manufacturer1 ComponentHeight: 0.55mm; HelpURL: \\cern.ch\dfs\Applications\Altium\Datasheets\R0603_NIC_NRC.pdf; Author: CERN DEM JLC; CreateDate: 03.12.2007; LatestRevisionDate: 13.03.2008
R166 R201 R223 R241 = R0402_15K_1%_0.0625W_100PPM: Resistor - 1%; Part Description: General Purpose Thick Film Chip Resistor; Manufacturer: GENERIC; Manufacturer1 Part Number: CRCW040215K0FKED; TC: ±100ppm/°C; PressFit: No; Part Number: R0402_15K_1%_0.0625W_100PPM; Component Kind: Standard; Component Type: Standard; Pin Count: 2; Value: 15k; Status: None; Power: 0.0625W; Tolerance: ±1%; Manufacturer Part Number: R0402_15K_1%_0.0625W_100PPM; Case: 0402; Mounted: Yes; Sense: No; Socket: No; SMD: Yes; Manufacturer1 Example: VISHAY; Manufacturer1 ComponentHeight: 0.4mm; HelpURL: \\cern.ch\dfs\Applications\Altium\Datasheets\R0402_VISHAY_CRCW e3.pdf; Author: CERN DEM JMW; CreateDate: 06.07.2015; LatestRevisionDate: 06.07.2015
R167 = R0603_4K7_1%_0.1W_100PPM: Resistor - 1%; Part Description: General Purpose Thick Film Chip Resistor; Manufacturer: GENERIC; Manufacturer1 Part Number: NRC06F4701TRF; Power: 0.1W; TC: ±100ppm/°C; PressFit: No; Part Number: R0603_4K7_1%_0.1W_100PPM; Component Kind: Standard; Component Type: Standard; Pin Count: 2; Value: 4k7; Status: Preferred; Tolerance: ±1%; Manufacturer Part Number: R0603_4K7_1%_0.1W_100PPM; Case: 0603; Mounted: Yes; Sense: No; Socket: No; SMD: Yes; Manufacturer1 Example: NIC COMPONENT; Manufacturer1 ComponentHeight: 0.55mm; HelpURL: \\cern.ch\dfs\Applications\Altium\Datasheets\R0603_NIC_NRC.pdf; Author: CERN DEM JLC; CreateDate: 03.12.2007; LatestRevisionDate: 13.03.2008
R180 R255 = R0603_10k_1%_0.1W_100PPM: Resistor - 1%; Part Description: General Purpose Thick Film Chip Resistor; Manufacturer: GENERIC; Manufacturer1 Part Number: NRC06F1002TRF; Power: 0.1W; TC: ±100ppm/°C; PressFit: No; Part Number: R0603_10K_1%_0.1W_100PPM; Component Kind: Standard; Component Type: Standard; Pin Count: 2; Value: 10k; Status: Preferred; Tolerance: ±1%; Manufacturer Part Number: R0603_10K_1%_0.1W_100PPM; Case: 0603; Mounted: Yes; Sense: No; Socket: No; SMD: Yes; Manufacturer1 Example: NIC COMPONENT; Manufacturer1 ComponentHeight: 0.55mm; HelpURL: \\cern.ch\dfs\Applications\Altium\Datasheets\R0603_NIC_NRC.pdf; Author: CERN DEM JLC; CreateDate: 03.12.2007; LatestRevisionDate: 13.03.2008
R181 R256 = R0603_20k_1%_0.1W_100PPM: Resistor - 1%; Part Description: General Purpose Thick Film Chip Resistor; Manufacturer: GENERIC; Manufacturer1 Part Number: NRC06F2002TRF; Power: 0.1W; TC: ±100ppm/°C; PressFit: No; Part Number: R0603_20K_1%_0.1W_100PPM; Component Kind: Standard; Component Type: Standard; Pin Count: 2; Value: 20k; Status: Preferred; Tolerance: ±1%; Manufacturer Part Number: R0603_20K_1%_0.1W_100PPM; Case: 0603; Mounted: Yes; Sense: No; Socket: No; SMD: Yes; Manufacturer1 Example: NIC COMPONENT; Manufacturer1 ComponentHeight: 0.55mm; HelpURL: \\cern.ch\dfs\Applications\Altium\Datasheets\R0603_NIC_NRC.pdf; Author: CERN DEM JLC; CreateDate: 03.12.2007; LatestRevisionDate: 13.03.2008
R197 = R0402_11K_1%_0.0625W_100PPM: Resistor - 1%; Part Description: General Purpose Thick Film Chip Resistor; Manufacturer: GENERIC; Manufacturer1 Part Number: 232270671103L; TC: ±100ppm/°C; PressFit: No; Part Number: R0402_11K_1%_0.0625W_100PPM; Component Kind: Standard; Component Type: Standard; Pin Count: 2; Value: 11k; Status: Not Recommended; Power: 0.0625W; Tolerance: ±1%; Manufacturer Part Number: R0402_11K_1%_0.0625W_100PPM; Case: 0402; Mounted: Yes; Sense: No; Socket: No; SMD: Yes; Manufacturer1 Example: YAGEO PHYCOMP; Manufacturer1 ComponentHeight: 0.4mm; HelpURL: \\cern.ch\dfs\Applications\Altium\Datasheets\R0402_Phycomp_RC0402.pdf; Author: CERN DEM JLC; CreateDate: 03.12.2007; LatestRevisionDate: 17.10.2012
R198 = R0402_43K_1%_0.0625W_100PPM: Resistor - 1%; Part Description: General Purpose Thick Film Chip Resistor; Manufacturer: GENERIC; Manufacturer1 Part Number: 232270674303L; TC: ±100ppm/°C; PressFit: No; Part Number: R0402_43K_1%_0.0625W_100PPM; Component Kind: Standard; Component Type: Standard; Pin Count: 2; Value: 43k; Status: Not Recommended; Power: 0.0625W; Tolerance: ±1%; Manufacturer Part Number: R0402_43K_1%_0.0625W_100PPM; Case: 0402; Mounted: Yes; Sense: No; Socket: No; SMD: Yes; Manufacturer1 Example: YAGEO PHYCOMP; Manufacturer1 ComponentHeight: 0.4mm; HelpURL: \\cern.ch\dfs\Applications\Altium\Datasheets\R0402_Phycomp_RC0402.pdf; Author: CERN DEM JLC; CreateDate: 03.12.2007; LatestRevisionDate: 17.10.2012
R200 = R0402_56K_1%_0.0625W_100PPM: Resistor - 1%; Part Description: General Purpose Thick Film Chip Resistor; Manufacturer: GENERIC; Manufacturer1 Part Number: 232270675603L; TC: ±100ppm/°C; PressFit: No; Part Number: R0402_56K_1%_0.0625W_100PPM; Component Kind: Standard; Component Type: Standard; Pin Count: 2; Value: 56k; Status: Not Recommended; Power: 0.0625W; Tolerance: ±1%; Manufacturer Part Number: R0402_56K_1%_0.0625W_100PPM; Case: 0402; Mounted: Yes; Sense: No; Socket: No; SMD: Yes; Manufacturer1 Example: YAGEO PHYCOMP; Manufacturer1 ComponentHeight: 0.4mm; HelpURL: \\cern.ch\dfs\Applications\Altium\Datasheets\R0402_Phycomp_RC0402.pdf; Author: CERN DEM JLC; CreateDate: 03.12.2007; LatestRevisionDate: 17.10.2012
R240 = R0603_1K_1%_0.1W_100PPM: Resistor - 1%; Part Description: General Purpose Thick Film Chip Resistor; Manufacturer: GENERIC; Manufacturer1 Part Number: NRC06F1001TRF; Power: 0.1W; TC: ±100ppm/°C; PressFit: No; Part Number: R0603_1K_1%_0.1W_100PPM; Component Kind: Standard; Component Type: Standard; Pin Count: 2; Value: 1k; Status: Preferred; Tolerance: ±1%; Manufacturer Part Number: R0603_1K_1%_0.1W_100PPM; Case: 0603; Mounted: Yes; Sense: No; Socket: No; SMD: Yes; Manufacturer1 Example: NIC COMPONENT; Manufacturer1 ComponentHeight: 0.55mm; HelpURL: \\cern.ch\dfs\Applications\Altium\Datasheets\R0603_NIC_NRC.pdf; Author: CERN DEM JLC; CreateDate: 03.12.2007; LatestRevisionDate: 13.03.2008
T10 = BC847BS: 45V 100mA Dual NPN General-Purpose Transistor; Manufacturer: NXP SEMICONDUCTORS; PressFit: No; Bonding: No; Part Number: BC847BS; Component Kind: Standard; Component Type: Standard; Device: BC847BS; PackageDescription: SOT363, SC-88, SOT, 0.65mm Pitch, 6 pin, 1.25mm W X 2.00mm L X 1.10mm H, IPC Medium Density; Part Description: 45V 100mA Dual NPN General-Purpose Transistor; Manufacturer Part Number: BC847BS; Pin Count: 6; Case: SOT363; Mounted: Yes; Socket: No; SMD: Yes; Sense: No; ComponentHeight: 1.1mm; HelpURL: \\cern.ch\dfs\Applications\Altium\Datasheets\BC847BS.pdf; Author: CERN DEM JMW; CreateDate: 10.07.2015; LatestRevisionDate: 10.07.2015
TP2 = TP: Testpoint